# Altium schematic sheet ULN2803+MOSFETS.SchDoc
size 297 x 209 mm
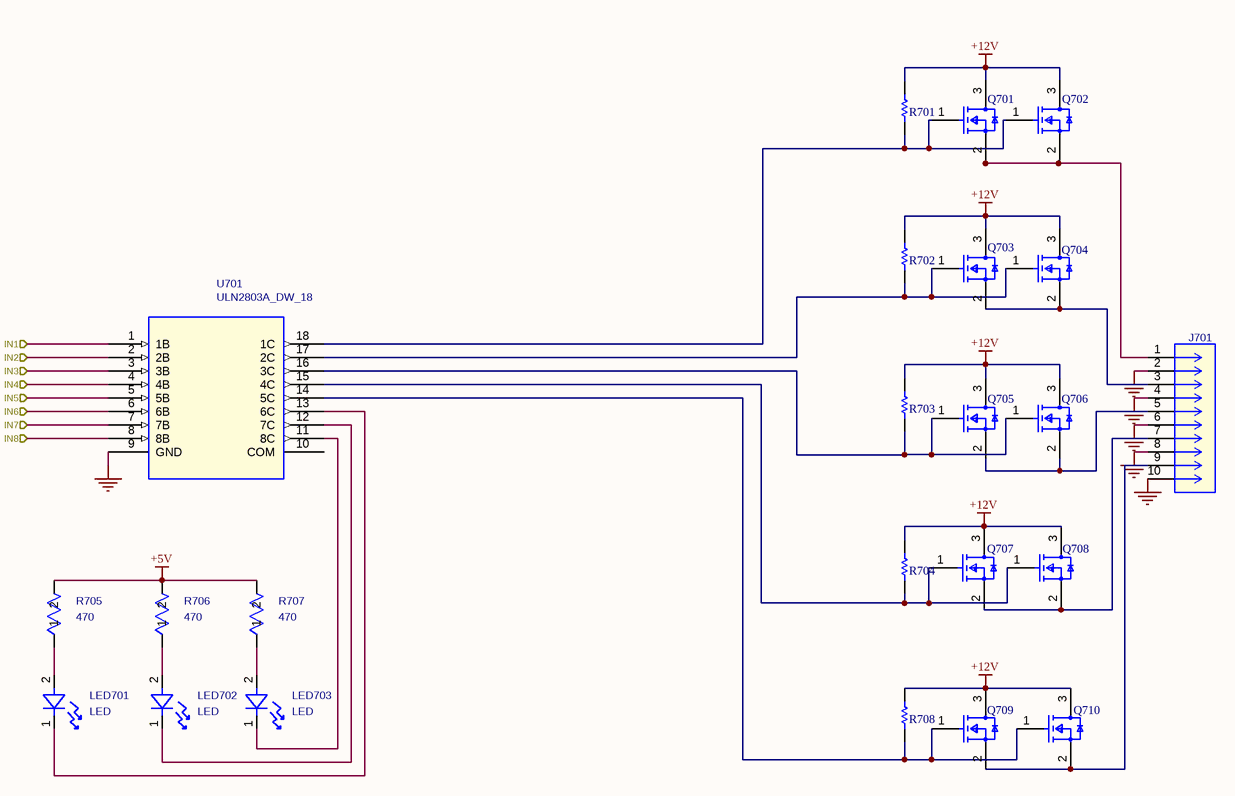
[diagram p0: ULN2803+MOSFETS.SchDoc]

## Parts
J701  CONN_1924389  [TerminalBlock_Phoenix_MKDS-3-10-5.08_1x10_P5.08mm_Horizontal]  (value not drawn)
LED701  LED  [LED_0805_2012Metric_Pad1.15x1.40mm_HandSolder]
LED702  LED  [LED_0805_2012Metric_Pad1.15x1.40mm_HandSolder]
LED703  LED  [LED_0805_2012Metric_Pad1.15x1.40mm_HandSolder]
Q701  3b9c635fedb024a5347a57b145af9cc  [FP-S-03946-IPC_C]  (value not drawn)
Q702  3b9c635fedb024a5347a57b145af9cc  [FP-S-03946-IPC_C]  (value not drawn)
Q703  3b9c635fedb024a5347a57b145af9cc  [FP-S-03946-IPC_C]  (value not drawn)
Q704  3b9c635fedb024a5347a57b145af9cc  [FP-S-03946-IPC_C]  (value not drawn)
Q705  3b9c635fedb024a5347a57b145af9cc  [FP-S-03946-IPC_C]  (value not drawn)
Q706  3b9c635fedb024a5347a57b145af9cc  [FP-S-03946-IPC_C]  (value not drawn)
Q707  3b9c635fedb024a5347a57b145af9cc  [FP-S-03946-IPC_C]  (value not drawn)
Q708  3b9c635fedb024a5347a57b145af9cc  [FP-S-03946-IPC_C]  (value not drawn)
Q709  3b9c635fedb024a5347a57b145af9cc  [FP-S-03946-IPC_C]  (value not drawn)
Q710  3b9c635fedb024a5347a57b145af9cc  [FP-S-03946-IPC_C]  (value not drawn)
R701  RC0603FR-075K6L  [RESC1608X55X25NL10T15]  (value not drawn)
R702  RC0603FR-075K6L  [RESC1608X55X25NL10T15]  (value not drawn)
R703  RC0603FR-075K6L  [RESC1608X55X25NL10T15]  (value not drawn)
R704  RC0603FR-075K6L  [RESC1608X55X25NL10T15]  (value not drawn)
R705  470  [R_0603_1608Metric_Pad0.98x0.95mm_HandSolder]
R706  470  [R_0603_1608Metric_Pad0.98x0.95mm_HandSolder]
R707  470  [R_0603_1608Metric_Pad0.98x0.95mm_HandSolder]
R708  RC0603FR-075K6L  [RESC1608X55X25NL10T15]  (value not drawn)
U701  ULN2803A_DW_18  [DW18]

## Ports
IN1 (in), IN2 (in), IN3 (in), IN4 (in), IN5 (in), IN6 (in), IN7 (in), IN8 (in)

## Nets
+5V: R705.2 R706.2 R707.2
+12V: Q701.3(D) Q702.3(D) Q703.3(D) Q704.3(D) Q705.3(D) Q706.3(D) Q707.3(D) Q708.3(D) Q709.3(D) Q710.3(D) R701.2 R702.2 R703.2 R704.2 R708.2
GNDD: J701.2 J701.4 J701.6 J701.8 J701.10 U701.9(GND)
IN1: U701.1(1B) ; port IN1
IN2: U701.2(2B) ; port IN2
IN3: U701.3(3B) ; port IN3
IN4: U701.4(4B) ; port IN4
IN5: U701.5(5B) ; port IN5
IN6: U701.6(6B) ; port IN6
IN7: U701.7(7B) ; port IN7
IN8: U701.8(8B) ; port IN8
NetJ701_1: J701.1 Q701.2(S) Q702.2(S)
NetJ701_3: J701.3 Q703.2(S) Q704.2(S)
NetJ701_5: J701.5 Q705.2(S) Q706.2(S)
NetJ701_7: J701.7 Q707.2(S) Q708.2(S)
NetJ701_9: J701.9 Q709.2(S) Q710.2(S)
NetLED701_1: LED701.1 U701.13(6C)
NetLED701_2: LED701.2 R705.1
NetLED702_1: LED702.1 U701.12(7C)
NetLED702_2: LED702.2 R706.1
NetLED703_1: LED703.1 U701.11(8C)
NetLED703_2: LED703.2 R707.1
NetQ701_1: Q701.1(G) Q702.1(G) R701.1 U701.18(1C)
NetQ703_1: Q703.1(G) Q704.1(G) R702.1 U701.17(2C)
NetQ705_1: Q705.1(G) Q706.1(G) R703.1 U701.16(3C)
NetQ707_1: Q707.1(G) Q708.1(G) R704.1 U701.15(4C)
NetQ709_1: Q709.1(G) Q710.1(G) R708.1 U701.14(5C)

Not connected (* = marked no-connect by the designer): U701 10(COM)

## Notes on the sheet
- THIS DOCUMENT AND THE DATA DISCLOSED HEREIN OR
- HEREWITH IS THE PROPERTY OF TEAM HAYA OFF ROADING AND MAY
- NOT BE FREELY DISTRIBUTED IN WHOLE. ALL RIGHTS ARE
- RESERVED AND NO EXPRESS OR IMPLIED WARANTEE IS GIVEN.

## Library data of the parts
J701 = 1924389: Mfr_Name: Phoenix Contact; Part Reference: J1; PCB Footprint: CONN_1924389_PXC; Copyright: Copyright (C) 2025 Ultra Librarian. All rights reserved.; Manufacturer_Part_Number: 1924389; Value: CONN_1924389; Part Number: 1924389; Manufacturer Part Number: 1924389; Manufacturer Name: Phoenix Contact
LED701 = QTLP600C3TR: https://sharvielectronics.com/product/yellow-led-17-21uyc-s530-a2-tr8-0805-package/; Mfr_Name: Everlight; Part Reference: LED1; PCB Footprint: LED_QTLP600C_EVE; Manufacturer_Part_Number: QTLP600C3TR; Copyright: Copyright (C) 2025 Ultra Librarian. All rights reserved.; Value: LED; Manufacturer Name: Everlight; Manufacturer Part Number: QTLP600C3TR; Part Number: QTLP600C3TR
LED702 = QTLP600C3TR: https://sharvielectronics.com/product/yellow-led-17-21uyc-s530-a2-tr8-0805-package/; Mfr_Name: Everlight; Part Reference: LED2; PCB Footprint: LED_QTLP600C_EVE; Manufacturer_Part_Number: QTLP600C3TR; Copyright: Copyright (C) 2025 Ultra Librarian. All rights reserved.; Value: LED; Manufacturer Name: Everlight; Manufacturer Part Number: QTLP600C3TR; Part Number: QTLP600C3TR
LED703 = QTLP600C3TR: https://sharvielectronics.com/product/yellow-led-17-21uyc-s530-a2-tr8-0805-package/; Mfr_Name: Everlight; Part Reference: LED3; PCB Footprint: LED_QTLP600C_EVE; Manufacturer_Part_Number: QTLP600C3TR; Copyright: Copyright (C) 2025 Ultra Librarian. All rights reserved.; Value: LED; Part Number: QTLP600C3TR; Manufacturer Part Number: QTLP600C3TR; Manufacturer Name: Everlight
Q701-Q710 = CMP-02550-000051-1: MOSFET N-CH 100V 1.15A SOT23-3; Manufacturer Part Number: SI2328DS-T1-E3; Manufacturer: Vishay; Pulse Drain Current: 6A; Reverse Recovery Time: 50ns; Max Forward Diode Voltage: 1.2V; Number Of Channels: 1; Transconductance: 4S; Standoff Height: 0.01mm; Max Junction Temp: +150°C; Threshold Vgs Min: 2V; Rthja Max: 130°C/W; Drain To Source Resistance: 0.195Ω; Turn On Delay Time: 7ns; Gate To Source Voltage: 20V; Depletion Mode: False; Threshold Vgs Max: 4V; Turn Off Delay Time: 9ns; Typ Forward Diode Voltage: 0.8V; Gate Charge At Vgs: 3.3nC @ 10V; Power Dissipation: 0.73W; Height: 1.12mm; Device Class L1: Discrete Semiconductors; Digikey Description: MOSFET N-CH 100V 1.15A SOT23-3; RoHS: TRUE; Temperature Range Low: -55°C; ComponentLink2URL: http://www.vishay.com/docs/71796/si2328ds.pdf; Octopart: https://octopart.com/si2328ds-t1-e3-vishay-40951139; Drain To Source Voltage: 100V; Lead Free: Yes; Continuous Drain Current: 1.15A; ComponentLink2Description: Datasheet; Package: S-03946; Automotive: No; Mouser Description: MOSFET 100V 1.5A; Device Class L3: MOSFETs; Temperature: -55°C to +150°C; Temperature Range High: +150°C; Device Class L2: Transistors; Ipc Land Pattern Name: SOT95P237X100-3; Drain To Source Breakdown Voltage: 100V; Category: Trans; Number Of N Channels: 1
R701-R704 R708 = CMP-1012-00595-2: Chip Resistor, 5.6 KOhm, +/- 1%, 0.1 W, -55 to 155 degC, 0603 (1608 Metric), RoHS, Tape and Reel; Voltage Rating: 50 V; Case\Package: 0603; Power Rating: 100 mW; Type (Resistor): Thick Film; Resistance: 332 kohm; ComponentLink1Description: Manufacturer URL; Case Code (Metric): 1608; Height: 0.45 mm; Min Operating Temperature: -55 degC; RoHSCompliant: true; ComponentLink2URL: http://www.yageo.com/documents/recent/PYu-RC_Group_51_RoHS_L_04.pdf; Length: 1.6 mm; ComponentLink2Description: Datasheet; Width: 0.8 mm; PackageReference: 0603; DatasheetVersion: Rev. 4, 02/2016; Package Quantity: 5000; Tolerance: 1%; Case Code (Imperial): 0603; PackageDescription: 2-Pin Surface Mount Device, Body 1.6 x 0.8 mm; ComponentLink1URL: http://www.yageo.com/; Max Operating Temperature: 155 degC; Packaging: Tape and Reel
R705 = CRGCQ0402F100K: Manufacturer_Part_Number: RCT02470RF; Mfr_Name: Unified Resistive Technologies; Part Reference: R1; PCB Footprint: RES_CRGCQ0402F100K_TEC; Copyright: Copyright (C) 2025 Ultra Librarian. All rights reserved.; Value: 470; Part Number: RCT02470RF; Manufacturer Part Number: RCT02470RF
R706 = CRGCQ0402F100K: Manufacturer_Part_Number: RCT02470RF; Mfr_Name: Unified Resistive Technologies; Part Reference: R2; PCB Footprint: RES_CRGCQ0402F100K_TEC; Copyright: Copyright (C) 2025 Ultra Librarian. All rights reserved.; Value: 470; Manufacturer Part Number: RCT02470RF; Part Number: RCT02470RF
R707 = CRGCQ0402F100K: Manufacturer_Part_Number: RCT02470RF; Mfr_Name: Unified Resistive Technologies; Part Reference: R3; PCB Footprint: RES_CRGCQ0402F100K_TEC; Copyright: Copyright (C) 2025 Ultra Librarian. All rights reserved.; Value: 470; Part Number: RCT02470RF; Manufacturer Part Number: RCT02470RF
U701 = ULN2803ADW: Mfr_Name: Texas Instruments; Part Reference: U4; Manufacturer_Part_Number: ULN2803ADW; Copyright: Copyright (C) 2025 Ultra Librarian. All rights reserved.; Value: ULN2803A_DW_18; PCB Footprint: DW18; Part Number: ULN2803ADW; Manufacturer Part Number: ULN2803ADW; Manufacturer Name: Texas Instruments